# EAGLE design board2sided (EAGLE 7.3.0)
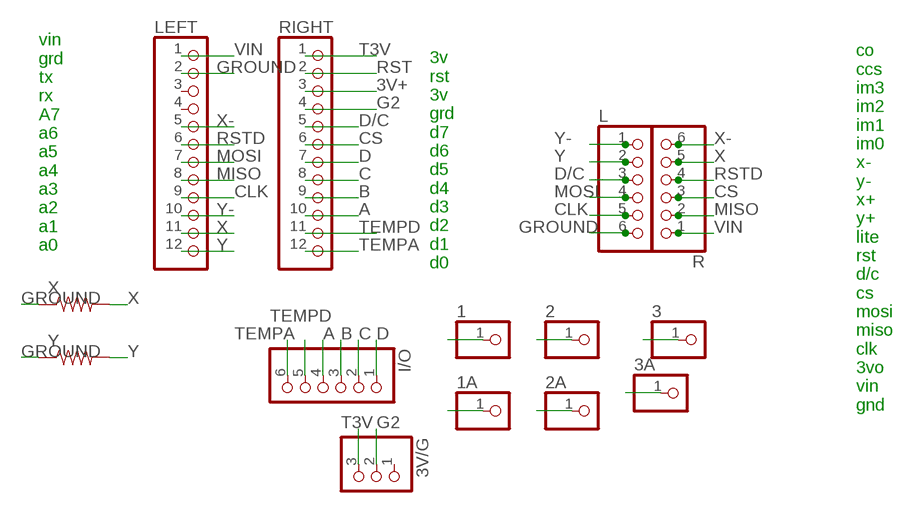
[diagram p0: schematic, sheet 1]

## Parts
1  PINHD-1X1CB  [1X01-CLEANBIG]
1A  PINHD-1X1CB  [1X01-CLEANBIG]
2  PINHD-1X1CB  [1X01-CLEANBIG]
2A  PINHD-1X1CB  [1X01-CLEANBIG]
3  PINHD-1X1CB  [1X01-CLEANBIG]
3A  PINHD-1X1CB  [1X01-CLEANBIG]
3V/G  PINHD-1X3CB  [1X03-CLEANBIG]
I/O  PINHD-1X6CB  [1X06-CLEANBIG]
L  PINHD-1X6CB  [1X06-CLEANBIG]
LEFT  PINHD-1X12-CB  [1X12-CB]
R  PINHD-1X6CB  [1X06-CLEANBIG]
RIGHT  PINHD-1X12-CB  [1X12-CB]
X  10KOHM-1/6W-5%(PTH)KIT  [AXIAL-0.3-KIT]
Y  10KOHM-1/6W-5%(PTH)KIT  [AXIAL-0.3-KIT]

## Nets
1: 1.1 1A.1
2: 2.1 2A.1
3: 3.1 3A.1
3V+: RIGHT.3
A: I/O.4 RIGHT.10
B: I/O.3 RIGHT.9
C: I/O.2 RIGHT.8
CLK: L.5 LEFT.9
CS: R.3 RIGHT.6
D: I/O.1 RIGHT.7
D/C: L.3 RIGHT.5
G2: 3V/G.2 RIGHT.4
GROUND: L.6 LEFT.2 X.P$1 Y.P$1
MISO: LEFT.8 R.2
MOSI: L.4 LEFT.7
RST: RIGHT.2
RSTD: LEFT.6 R.4
T3V: 3V/G.3 RIGHT.1
TEMPA: I/O.6 RIGHT.12
TEMPD: I/O.5 RIGHT.11
VIN: LEFT.1 R.1
X: LEFT.11 R.5 X.P$2
X-: LEFT.5 R.6
Y: L.2 LEFT.12 Y.P$2
Y-: L.1 LEFT.10
Unconnected: 3V/G.1 LEFT.3 LEFT.4

## Notes on the sheet
- vin
  grd
  tx
  rx
  A7
  a6
  a5
  a4
  a3
  a2
  a1
  a0
- 3v
  rst
  3v
  grd
  d7
  d6
  d5
  d4
  d3
  d2
  d1
  d0
- co
  ccs
  im3
  im2
  im1
  im0
  x-
  y-
  x+
  y+
  lite
  rst
  d/c
  cs
  mosi
  miso
  clk
  3vo
  vin
  gnd

## Library data of the parts
1 1A 2 2A 3 3A = adafruit:PINHD-1X1: Pin header 1x1 for 0.1" spacing With round pins
3V/G = adafruit:PINHD-1X3: PIN HEADER
I/O L R = adafruit:PINHD-1X6: PIN HEADER
LEFT RIGHT = adafruit:PINHD-1X12: PIN HEADER
X Y = SparkFun-Resistors:10KOHM-1/6W-5%(PTH): RES-08375; PROD_ID: RES-08375

## Board
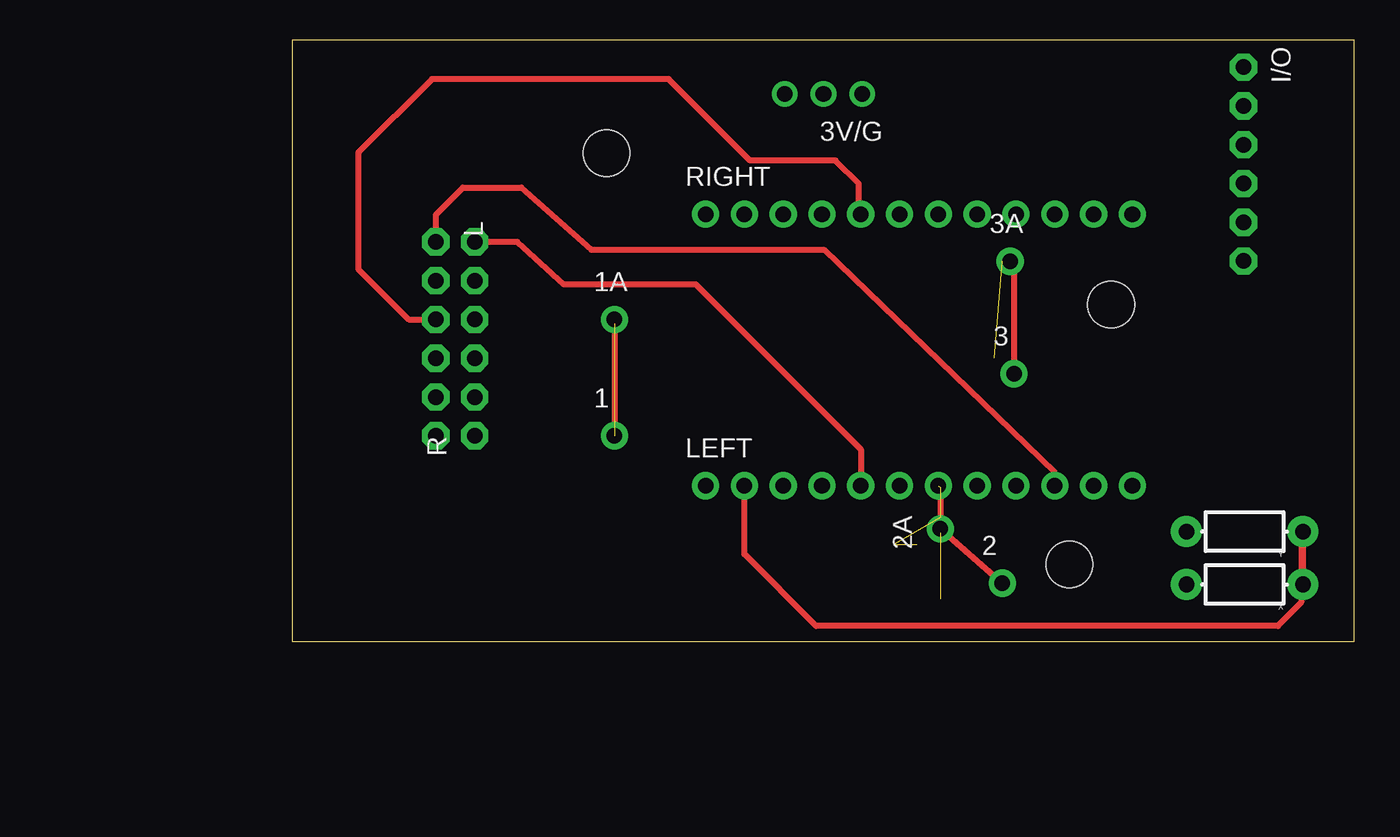
[diagram p1: board, top side]
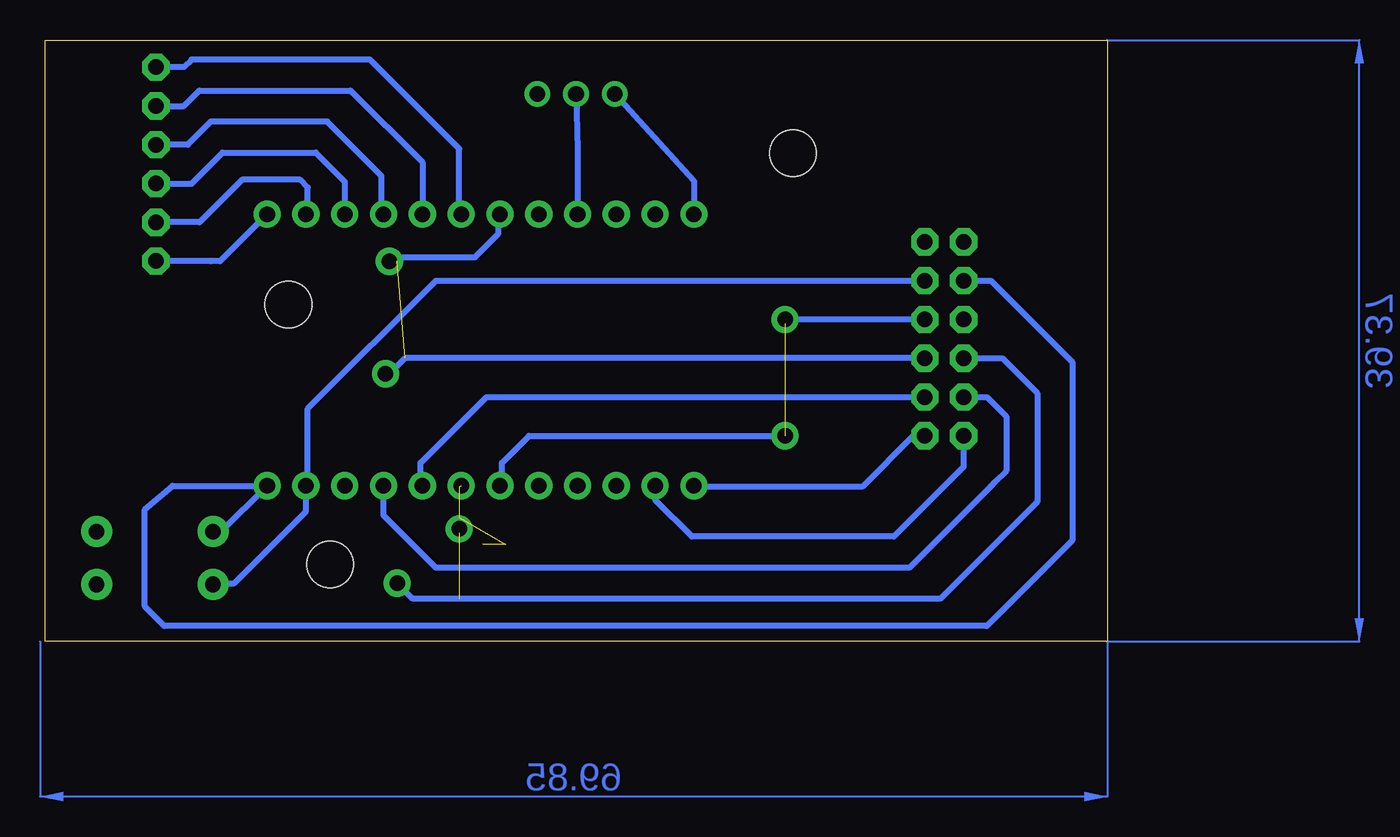
[diagram p2: board, bottom side, seen from below]

Size 69.52 x 39.36 mm. Coordinates in mm from the lower left corner, seen from the top.
Outline: 0,0 69.52,0 69.52,39.36 0,39.36 0,0
Copper layers (1*16): Top 0.035mm / dielectric 1.5mm / Bottom 0.035mm
Design rules "Othermill-DRC-1-32": minimum track width 8mil, minimum drill 0.8mm, track to track 0.794003125mm, track to pad 0.794003125mm, pad to pad 0.794003125mm, via to via 0.794003125mm, smd to smd 0mil, copper to edge 0mil, drill to drill 1mil, minimum pad ring 10mil, minimum via ring 10mil, stop-mask expansion 1mil, vias tented up to drill 30mil, thermal gap 10mil

### Footprints (pad centres in the part's own frame; a part is rotated, then mirrored left to right if it is on the bottom)
1X01-CLEANBIG = drill 1.016 pad 1.778: 1 0,0
1X03-CLEANBIG = drill 1.016 pad 1.676: 1 -2.54,0; 2 0,0; 3 2.54,0
1X06-CLEANBIG = drill 1.016 pad 1.778 octagon: 1 -6.35,0; 2 -3.81,0; 3 -1.27,0; 4 1.27,0; 5 3.81,0; 6 6.35,0
1X12-CB = drill 1.016 pad 1.778: 1 -13.97,0; 2 -11.43,0; 3 -8.89,0; 4 -6.35,0; 5 -3.81,0; 6 -1.27,0; 7 1.27,0; 8 3.81,0; 9 6.35,0; 10 8.89,0; 11 11.43,0; 12 13.97,0
STAND-OFF-TIGHT = hole 3.048: 0,0
AXIAL-0.3-KIT = drill 1.016 pad 2.032: P$1 -3.81,0; P$2 3.81,0

### Placement (x,y rotation side)
1  21.08,13.46 0 top
1A  21.08,21.08 0 top
2  46.48,3.81 0 top
2A  42.42,7.37 90 top
3  47.24,17.53 0 top
3A  46.99,24.89 0 top
3V/G  34.77,35.85 180 top
I/O  62.27,31.25 270 top
L  9.4,19.81 270 top
LEFT  41.02,10.19 0 top
R  11.94,19.81 90 top
RIGHT  41.02,27.97 0 top
U$1  [STAND-OFF-TIGHT]  53.6,22.05 0 top
U$2  [STAND-OFF-TIGHT]  20.56,31.97 90 top
U$3  [STAND-OFF-TIGHT]  50.88,5.03 0 top
X  62.34,3.73 180 top
Y  62.34,7.19 180 top

### Tracks (layer width: path | path; a pad name or v marks a point on that pad's centre or on a via)
1
  Top 0.406: 1A.1 1.1
2
  Top 0.406: 2.1 2A.1
3
  Top 0.406: 3A.1 47.24,24.64 3.1
A
  Bottom 0.406: I/O.4 62.26,29.97 59.94,29.97 57.91,32 51.82,32 49.91,30.1 RIGHT.10
B
  Bottom 0.406: RIGHT.9 47.5,28.1 47.5,30.48 51.05,34.04 58.67,34.04 60.19,32.52 I/O.3
C
  Bottom 0.406: I/O.2 62.26,35.05 60.45,35.05 59.44,36.07 49.53,36.07 44.83,31.37 RIGHT.8
CLK
  Bottom 0.406: LEFT.9 47.37,8.25 43.94,4.83 12.95,4.83 7.62,10.16 7.37,10.41 6.6,11.18 6.6,14.73 7.87,16 L.5
CS  (1 unrouted)
  Bottom 0.406: RIGHT.6 39.88,27.84 39.88,26.67 41.4,25.15 46.23,25.15 46.48,24.89 46.99,24.89 | R.3 45.97,18.54 46.99,17.53 47.24,17.53
D
  Bottom 0.406: RIGHT.7 42.42,28.1 42.42,32.26 48.26,38.1 59.94,38.1 60.44,37.6 I/O.1
D/C
  Top 0.406: L.3 7.62,21.08 4.32,24.38 4.32,32 9.14,36.83 24.54,36.83 24.64,36.83 29.97,31.5 35.56,31.5 37.08,29.97 37.08,28.1 RIGHT.5
G2
  Bottom 0.406: 3V/G.2 34.67,32.2 RIGHT.4
GROUND
  Top 0.406: X.P$1 Y.P$1 66.04,7.08 66.04,2.54 64.52,1.02 34.29,1.02 29.59,5.72 LEFT.2
  Bottom 0.406: L.6 9.4,11.43 13.97,6.86 27.18,6.86 29.59,9.27 LEFT.2
MISO
  Bottom 0.406: LEFT.8 44.96,10.32 44.96,11.68 40.64,16 R.2
MOSI  (5 unrouted)
  Top 0.406: LEFT.7 42.42,10.06 42.42,7.11
  Bottom 0.406: L.4 6.86,18.54 4.57,16.26 4.57,9.14 10.92,2.79 45.47,2.79 46.48,3.81
RSTD  (1 unrouted)
  Bottom 0.406: LEFT.6 39.62,10.32 39.62,11.68 37.85,13.46 21.08,13.46 | R.4 21.08,21.08 21.08,20.83
T3V
  Bottom 0.406: 3V/G.3 27.05,30.17 RIGHT.1
TEMPA
  Bottom 0.406: RIGHT.12 58.07,24.89 58.67,24.89 58.69,24.9 I/O.6
TEMPD
  Bottom 0.406: RIGHT.11 52.32,28.1 52.32,29.72 52.83,30.23 56.64,30.23 59.42,27.44 I/O.5
VIN
  Bottom 0.406: LEFT.1 27.02,10.16 | 27.02,10.16 26.92,10.16 16,10.16 12.7,13.46 R.1 | 27.02,10.16 27.18,10.16
X
  Bottom 0.406: X.P$2 58.45,3.81 57.15,3.81 52.45,8.51 LEFT.11 52.32,10.32 52.32,15.24 43.94,23.62 R.5
X-
  Top 0.406: R.6 14.73,26.16 17.78,23.37 26.42,23.37 37.21,12.57 LEFT.5
Y
  Bottom 0.406: Y.P$2 57.99,7.19 LEFT.12 61.18,10.19 62.99,8.64 62.99,2.29 61.72,1.02 7.87,1.02 2.29,6.6 2.29,18.29 7.62,23.62 L.2
Y-
  Top 0.406: L.1 9.4,27.94 11.18,29.72 14.99,29.72 19.56,25.65 34.8,25.65 49.91,11.05 LEFT.10
(copper drawn outside any net)
  shapes: Bottom area x2